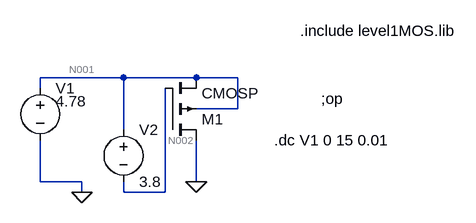
[diagram p0: schematic pmos_test.asc]
pmos_test.asc, the LTspice schematic file:
Version 4
SHEET 1 880 680
WIRE 64 96 -64 96
WIRE 176 96 64 96
WIRE 240 96 176 96
WIRE -64 112 -64 96
WIRE 240 144 240 96
WIRE 240 144 176 144
WIRE 64 176 64 96
WIRE -64 256 -64 192
WIRE 0 256 -64 256
WIRE 176 256 176 192
WIRE 0 272 0 256
WIRE 64 272 64 256
WIRE 128 272 128 112
WIRE 128 272 64 272
FLAG 0 272 0
FLAG 176 256 0
SYMBOL voltage -64 96 R0
WINDOW 123 0 0 Left 2
WINDOW 39 0 0 Left 2
WINDOW 3 24 36 Left 2
SYMATTR Value2 ""
SYMATTR SpiceLine ""
SYMATTR Value 4.78
SYMATTR InstName V1
SYMBOL voltage 64 160 R0
WINDOW 123 0 0 Left 2
WINDOW 39 0 0 Left 2
SYMATTR Value2 ""
SYMATTR SpiceLine ""
SYMATTR InstName V2
SYMATTR Value 3.8
SYMBOL cmosp 128 192 M180
SYMATTR InstName M1
SYMATTR SpiceModel ""
SYMATTR Value2 l=0.3u w=3u
SYMATTR SpiceLine ""
SYMATTR SpiceLine2 ""
TEXT 336 24 Left 2 !.include level1MOS.lib
TEXT 368 128 Left 2 !;op
TEXT 296 192 Left 2 !.dc V1 0 15 0.01

The netlist it stands for:
* pmos_test.asc
V1 N001 0 4.78
V2 N001 N002 3.8
M1 0 N002 N001 N001 CMOSP l=0.3u w=3u
.model NMOS NMOS
.model PMOS PMOS
.lib standard.mos
.include level1MOS.lib
;op
.dc V1 0 15 0.01
.backanno
.end

* Results of the author's LTspice run, read from the files saved beside the schematic
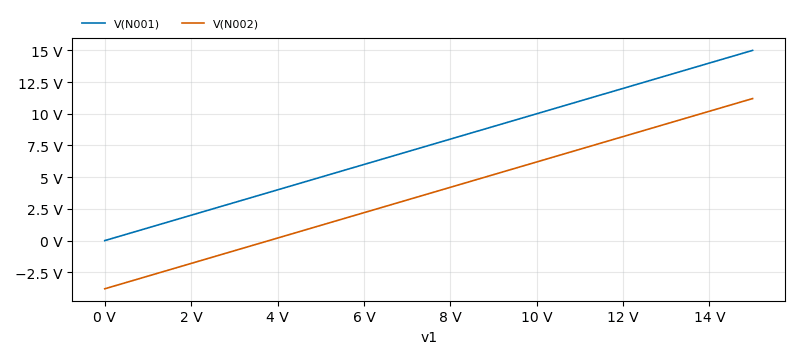
[diagram p1: DC transfer characteristic of pmos_test.asc, plotted from the saved traces]
* DC transfer characteristic, 1 run:
*   V(N001): 0 V at v1=0 V, 15 V at v1=15 V, min 0 V, max 15 V
*   V(N002): -3.8 V at v1=0 V, 11.2 V at v1=15 V, min -3.8 V, max 11.2 V